# Altium schematic sheet Mixer.SchDoc
size A3
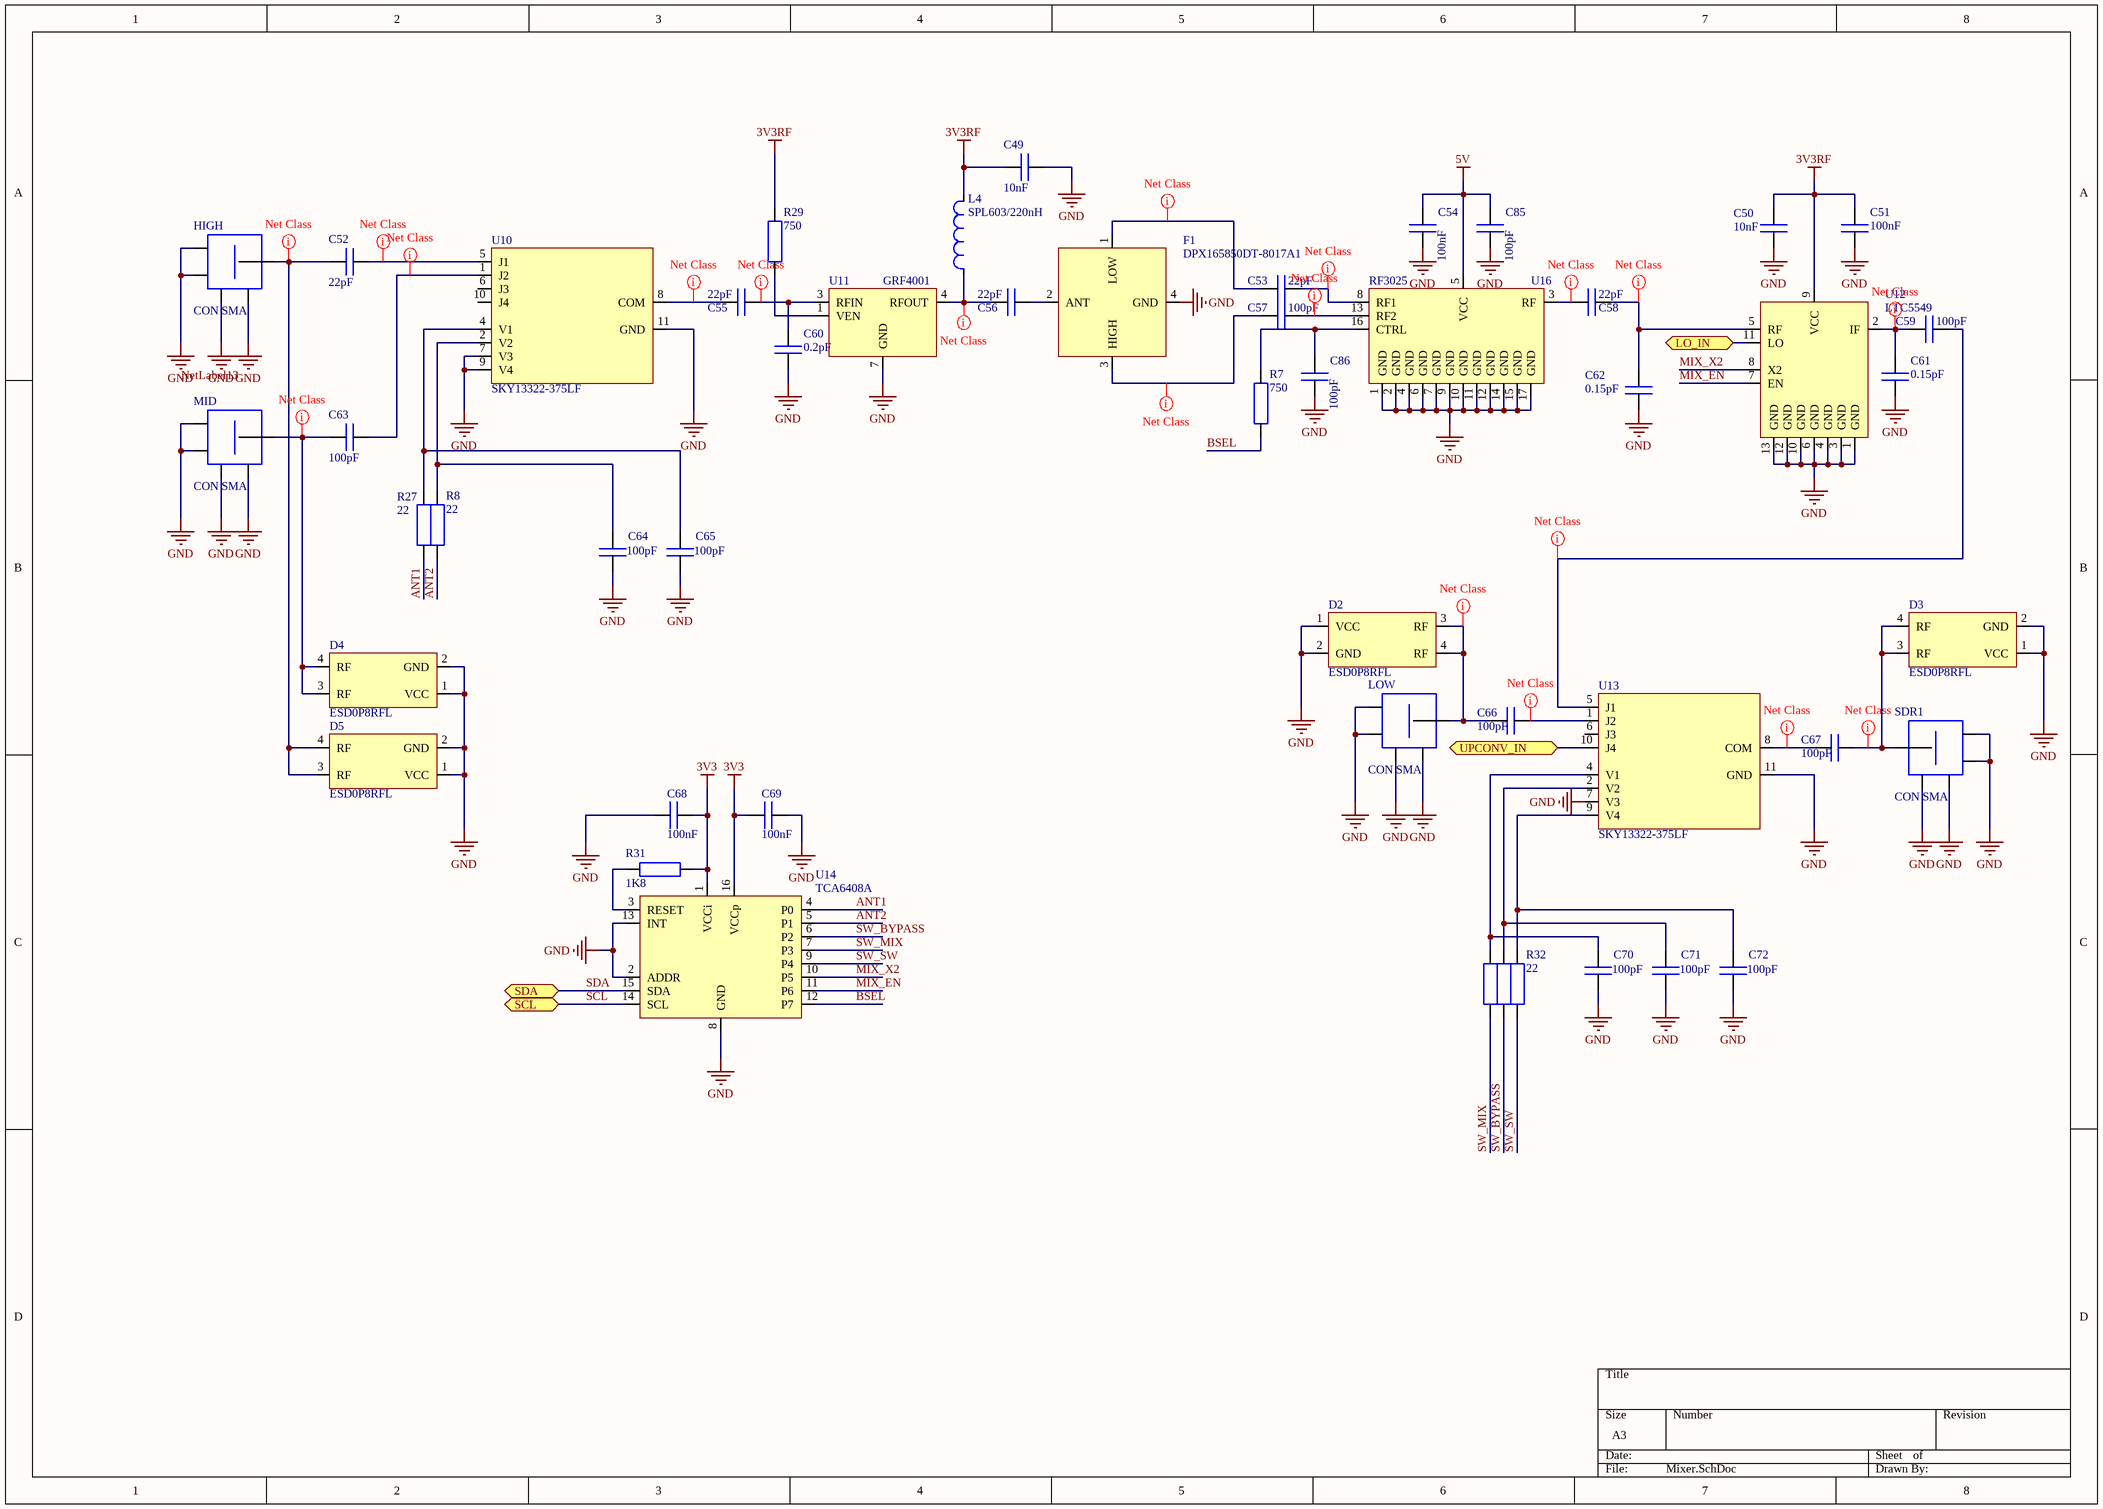
[diagram p0: Mixer.SchDoc]

## Parts
C49  10nF  [smd C0402]
C50  10nF  [smd C0402]
C51  100nF  [smd C0603_0.80]
C52  22pF  [smd C0402]
C53  22pF  [smd C0402]
C54  100nF  [smd C0603_0.80]
C55  22pF  [smd C0402]
C56  22pF  [smd C0402]
C57  100pF  [smd C0402]
C58  22pF  [smd C0402]
C59  100pF  [smd C0402]
C60  0.2pF  [smd C0402]
C61  0.15pF  [smd C0402]
C62  0.15pF  [smd C0402]
C63  100pF  [smd C0402]
C64  100pF  [smd C0603_0.80]
C65  100pF  [smd C0603_0.80]
C66  100pF  [smd C0402]
C67  100pF  [smd C0402]
C68  100nF  [smd C0603_0.80]
C69  100nF  [smd C0603_0.80]
C70  100pF  [smd C0603_0.80]
C71  100pF  [smd C0603_0.80]
C72  100pF  [smd C0603_0.80]
C85  100pF  [smd C0603_0.80]
C86  100pF  [smd C0603_0.80]
D2  ESD0P8RFL  [ESD0P8RFL]
D3  ESD0P8RFL  [ESD0P8RFL]
D4  ESD0P8RFL  [ESD0P8RFL]
D5  ESD0P8RFL  [ESD0P8RFL]
F1  DPX165850DT-8017A1  [DPX165850DT-8017A1]
HIGH  CON SMA  [con SMA (recht)]
L4  SPL603/220nH  [smd C0603]
LOW  CON SMA  [con SMA (recht)]
MID  CON SMA  [con SMA (recht)]
R7  750  [smd C0603_0.45]
R8  22  [smd C0603_0.45]
R27  22  [smd C0603_0.45]
R28  22  [smd C0603_0.45]  (value not drawn)
R29  750  [smd C0603_0.45]
R30  22  [smd C0603_0.45]  (value not drawn)
R31  1K8  [smd C0805_0.50]
R32  22  [smd C0603_0.45]
SDR1  CON SMA  [con SMA (recht)]
U10  SKY13322-375LF  [QFN50P200X300X80-10N]
U11  GRF4001  [GRF4001]
U12  LTC5549  [LTC5549]
U13  SKY13322-375LF  [QFN50P200X300X80-10N]
U14  TCA6408A  [TSOP65P640X100-16M]
U16  RF3025  [QFN50P300X300X100-16N]

## Ports
LO_IN, SCL, SDA, UPCONV_IN

## Nets
3V3: C68.2 C69.1 R31.1 U14.1(VCCi) U14.16(VCCp)
3V3RF: C49.2 C50.2 C51.2 L4.2 R29.2 U12.9(VCC)
5V: C54.2 C85.2 U16.5(VCC)
GND: C49.1 C50.1 C51.1 C54.1 C60.1 C61.1 C62.1 C64.1 C65.1 C68.1 C69.2 C70.1 C71.1 C72.1 C85.1 C86.1 D2.1(VCC) D2.2(GND) D3.1(VCC) D3.2(GND) D4.1(VCC) D4.2(GND) D5.1(VCC) D5.2(GND) F1.4(GND) HIGH.2 HIGH.3 HIGH.4 HIGH.5 LOW.2 LOW.3 LOW.4 LOW.5 MID.2 MID.3 MID.4 MID.5 SDR1.2 SDR1.3 SDR1.4 SDR1.5 U10.7(V3) U10.9(V4) U10.11(GND) U11.7(GND) U12.1(GND) U12.3(GND) U12.4(GND) U12.6(GND) U12.10(GND) U12.12(GND) U12.13(GND) U13.7(V3) U13.11(GND) U14.2(ADDR) U14.8(GND) U14.13(INT) U16.1(GND) U16.2(GND) U16.4(GND) U16.6(GND) U16.7(GND) U16.9(GND) U16.10(GND) U16.11(GND) U16.12(GND) U16.14(GND) U16.15(GND) U16.17(GND)
ANT1: R27.2 U14.4(P0)
ANT2: R8.1 U14.5(P1)
BSEL: R7.1 U14.12(P7)
LO_IN: U12.11(LO) ; port LO_IN
MIX_EN: U12.7(EN) U14.11(P6)
MIX_X2: U12.8(X2) U14.10(P5)
SCL: U14.14(SCL) ; port SCL
SDA: U14.15(SDA) ; port SDA
SW_BYPASS: R30.1 U14.6(P2)
SW_MIX: R28.1 U14.7(P3)
SW_SW: R32.1 U14.9(P4)
UPCONV_IN: U13.10(J4) ; port UPCONV_IN
NetC52_1: C52.1 U10.5(J1)
NetC52_2: C52.2 D5.3(RF) D5.4(RF) HIGH.1
NetC53_1: C53.1 F1.1(LOW)
NetC53_2: C53.2 U16.8(RF1)
NetC55_1: C55.1 U10.8(COM)
NetC55_2: C55.2 C60.2 U11.3(RFIN)
NetC56_1: C56.1 L4.1 U11.4(RFOUT)
NetC56_2: C56.2 F1.2(ANT)
NetC57_1: C57.1 F1.3(HIGH)
NetC57_2: C57.2 U16.13(RF2)
NetC58_1: C58.1 U16.3(RF)
NetC58_2: C58.2 C62.2 U12.5(RF)
NetC59_1: C59.1 C61.2 U12.2(IF)
NetC59_2: C59.2 U13.5(J1)
NetC63_1: C63.1 U10.1(J2)
NetC63_2: C63.2 D4.3(RF) D4.4(RF) MID.1
NetC64_2: C64.2 R8.2 U10.2(V2)
NetC65_2: C65.2 R27.1 U10.4(V1)
NetC66_1: C66.1 D2.3(RF) D2.4(RF) LOW.1
NetC66_2: C66.2 U13.1(J2)
NetC67_1: C67.1 U13.8(COM)
NetC67_2: C67.2 D3.3(RF) D3.4(RF) SDR1.1
NetC70_2: C70.2 R28.2 U13.4(V1)
NetC71_2: C71.2 R30.2 U13.2(V2)
NetC72_2: C72.2 R32.2 U13.9(V4)
NetC86_2: C86.2 R7.2 U16.16(CTRL)
NetR29_1: R29.1 U11.1(VEN)
NetR31_2: R31.2 U14.3(RESET)

Not connected (* = marked no-connect by the designer): U10 6(J3) 10(J4); U13 6(J3)

## Layout directives
net class RF: NetC52_1, NetC52_2, NetC53_1, NetC53_2, NetC55_1, NetC55_2, NetC56_1, NetC57_1, NetC57_2, NetC58_1, NetC58_2, NetC59_1, NetC59_2, NetC63_1, NetC63_2, NetC66_1, NetC66_2, NetC67_1, NetC67_2

## Notes on the sheet
- Labels drawn without touching a wire or pin: NetLabel13

## Library data of the parts
C49 C50 = CSMD402/100nF: smd capaciteit, verp.0402, 10nF; Part Number: CSMD402/100nF; Component Kind: Standard; Component Type: Standard; Designator: CSMD402/100nF; Pin Count: 2; Supplier 1: Farnell
C51 C54 C68 C69 = CSMD603/100nF: smd capaciteit, verp.0603, 100nF; Part Number: CSMD603/100nF; Component Kind: Standard; Component Type: Standard; Designator: CSMD603/100nF; Pin Count: 2
  C51 C54: Supplier 1: Farnell
C52 C53 C55-C63 C66 C67 = CSMD402/22pF: smd capaciteit, verp.0402, 22pF; Part Number: CSMD402/22pF; Component Kind: Standard; Component Type: Standard; Designator: CSMD402/22pF; Pin Count: 2; Supplier 1: Farnell
C64 C65 C70-C72 C85 C86 = CSMD603/100pF: smd capaciteit, verp.0603, 100pF; Part Number: CSMD603/100pF; Component Kind: Standard; Component Type: Standard; Designator: CSMD603/100pF; Pin Count: 2; Supplier 1: Farnell
HIGH LOW MID SDR1 = CON SMA: SMA connector, rechtop; Part Number: CON SMA; Component Kind: Standard; Component Type: Standard; Designator: CON SMA; Pin Count: 5; Supplier 1: Farnell
R7 R8 R27-R30 R32 = 750R/603: weerstand SMD603, 750R; Supplier 1: Farnell
R31 = 1K8/805: weerstand SMD805, 1K8
L4 = SPL603/220nH: Component Kind: Standard; Supplier 1: Farnell